# Altium schematic sheet FMC_POF.SchDoc
size A3; DrawnBy: Gustavo Bruno; Engineer: Gustavo Bruno; DocumentName: FMC-5CH-POF
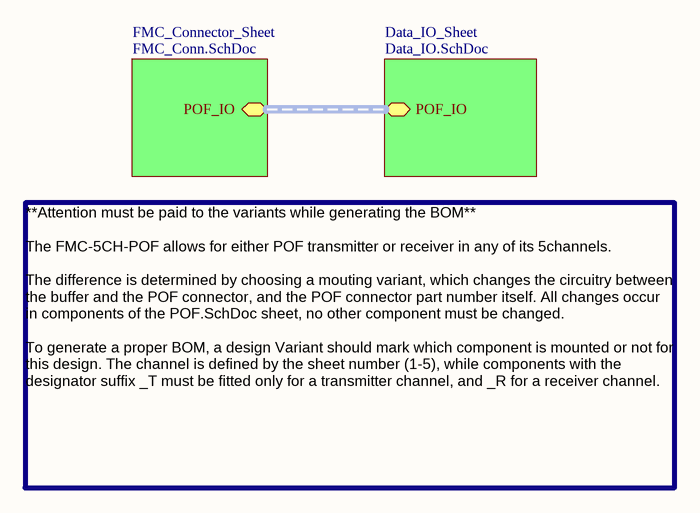
[diagram p0: FMC_POF.SchDoc]

## Parts
(Parts that share a designator on the sheet are numbered #1, #2 ... from top to bottom, then left to right.)
?#1  (no value)
?#2  (no value)
?#3  (no value)
?#4  (no value)

## Sub-sheets
Data_IO_Sheet = Data_IO.SchDoc: POF_IO (harness POF_IO)
FMC_Connector_Sheet = FMC_Conn.SchDoc: POF_IO (harness POF_IO)

## Buses and harness runs
harness sheet Data_IO_Sheet/POF_IO = sheet FMC_Connector_Sheet/POF_IO

## Notes on the sheet
- **Attention must be paid to the variants while generating the BOM**
  The FMC-5CH-POF allows for either POF transmitter or receiver in any of its 5channels.
  The difference is determined by choosing a mouting variant, which changes the circuitry between the buffer and the POF connector, and the POF connector part number itself. All changes occur in components of the POF.SchDoc sheet, no other component must be changed.
  To generate a proper BOM, a design Variant should mark which component is mounted or not for this design. The channel is defined by the sheet number (1-5), while components with the designator suffix _T must be fitted only for a transmitter channel, and _R for a receiver channel.
- Title:
- Date:
- Project:
- Drawn by:
- Time:
- Commit:
- Revised by:
- Sheet
- of
- Grupo de diagnóstico do feixe -
  DIG - LNLS
- File:
- Copyright LNLS 2012.
  This documentation describes Open Hardware and is licensed under the CERN OHL v.1.1. You may redistribute and modify this documentation under the terms of the CERN OHL v.1.1. (http://ohwr.org/CERNOHL). This documentation is distributed WITHOUT ANY EXPRESS OR IMPLIED WARRANTY, INCLUDING OF MERCHANTABILITY, SATISFACTORY QUALITY AND FITNESS FOR A PARTICULAR PURPOSE. Please see the CERN OHL v.1.1 for applicable conditions.

## Library data of the parts
?#1-?#4 = FIDUCIAL_TARGET_S100-200: Fiducial Target